# EasyEDA schematic 1-Schematic_LBB_Pi_HAT_V2.json
TITLE: LBB_Pi_HAT_V2; REV: 2.0; Date: 2020-11-04; Sheet: 1/1; Drawn By: rebusjwf; Company: LBB
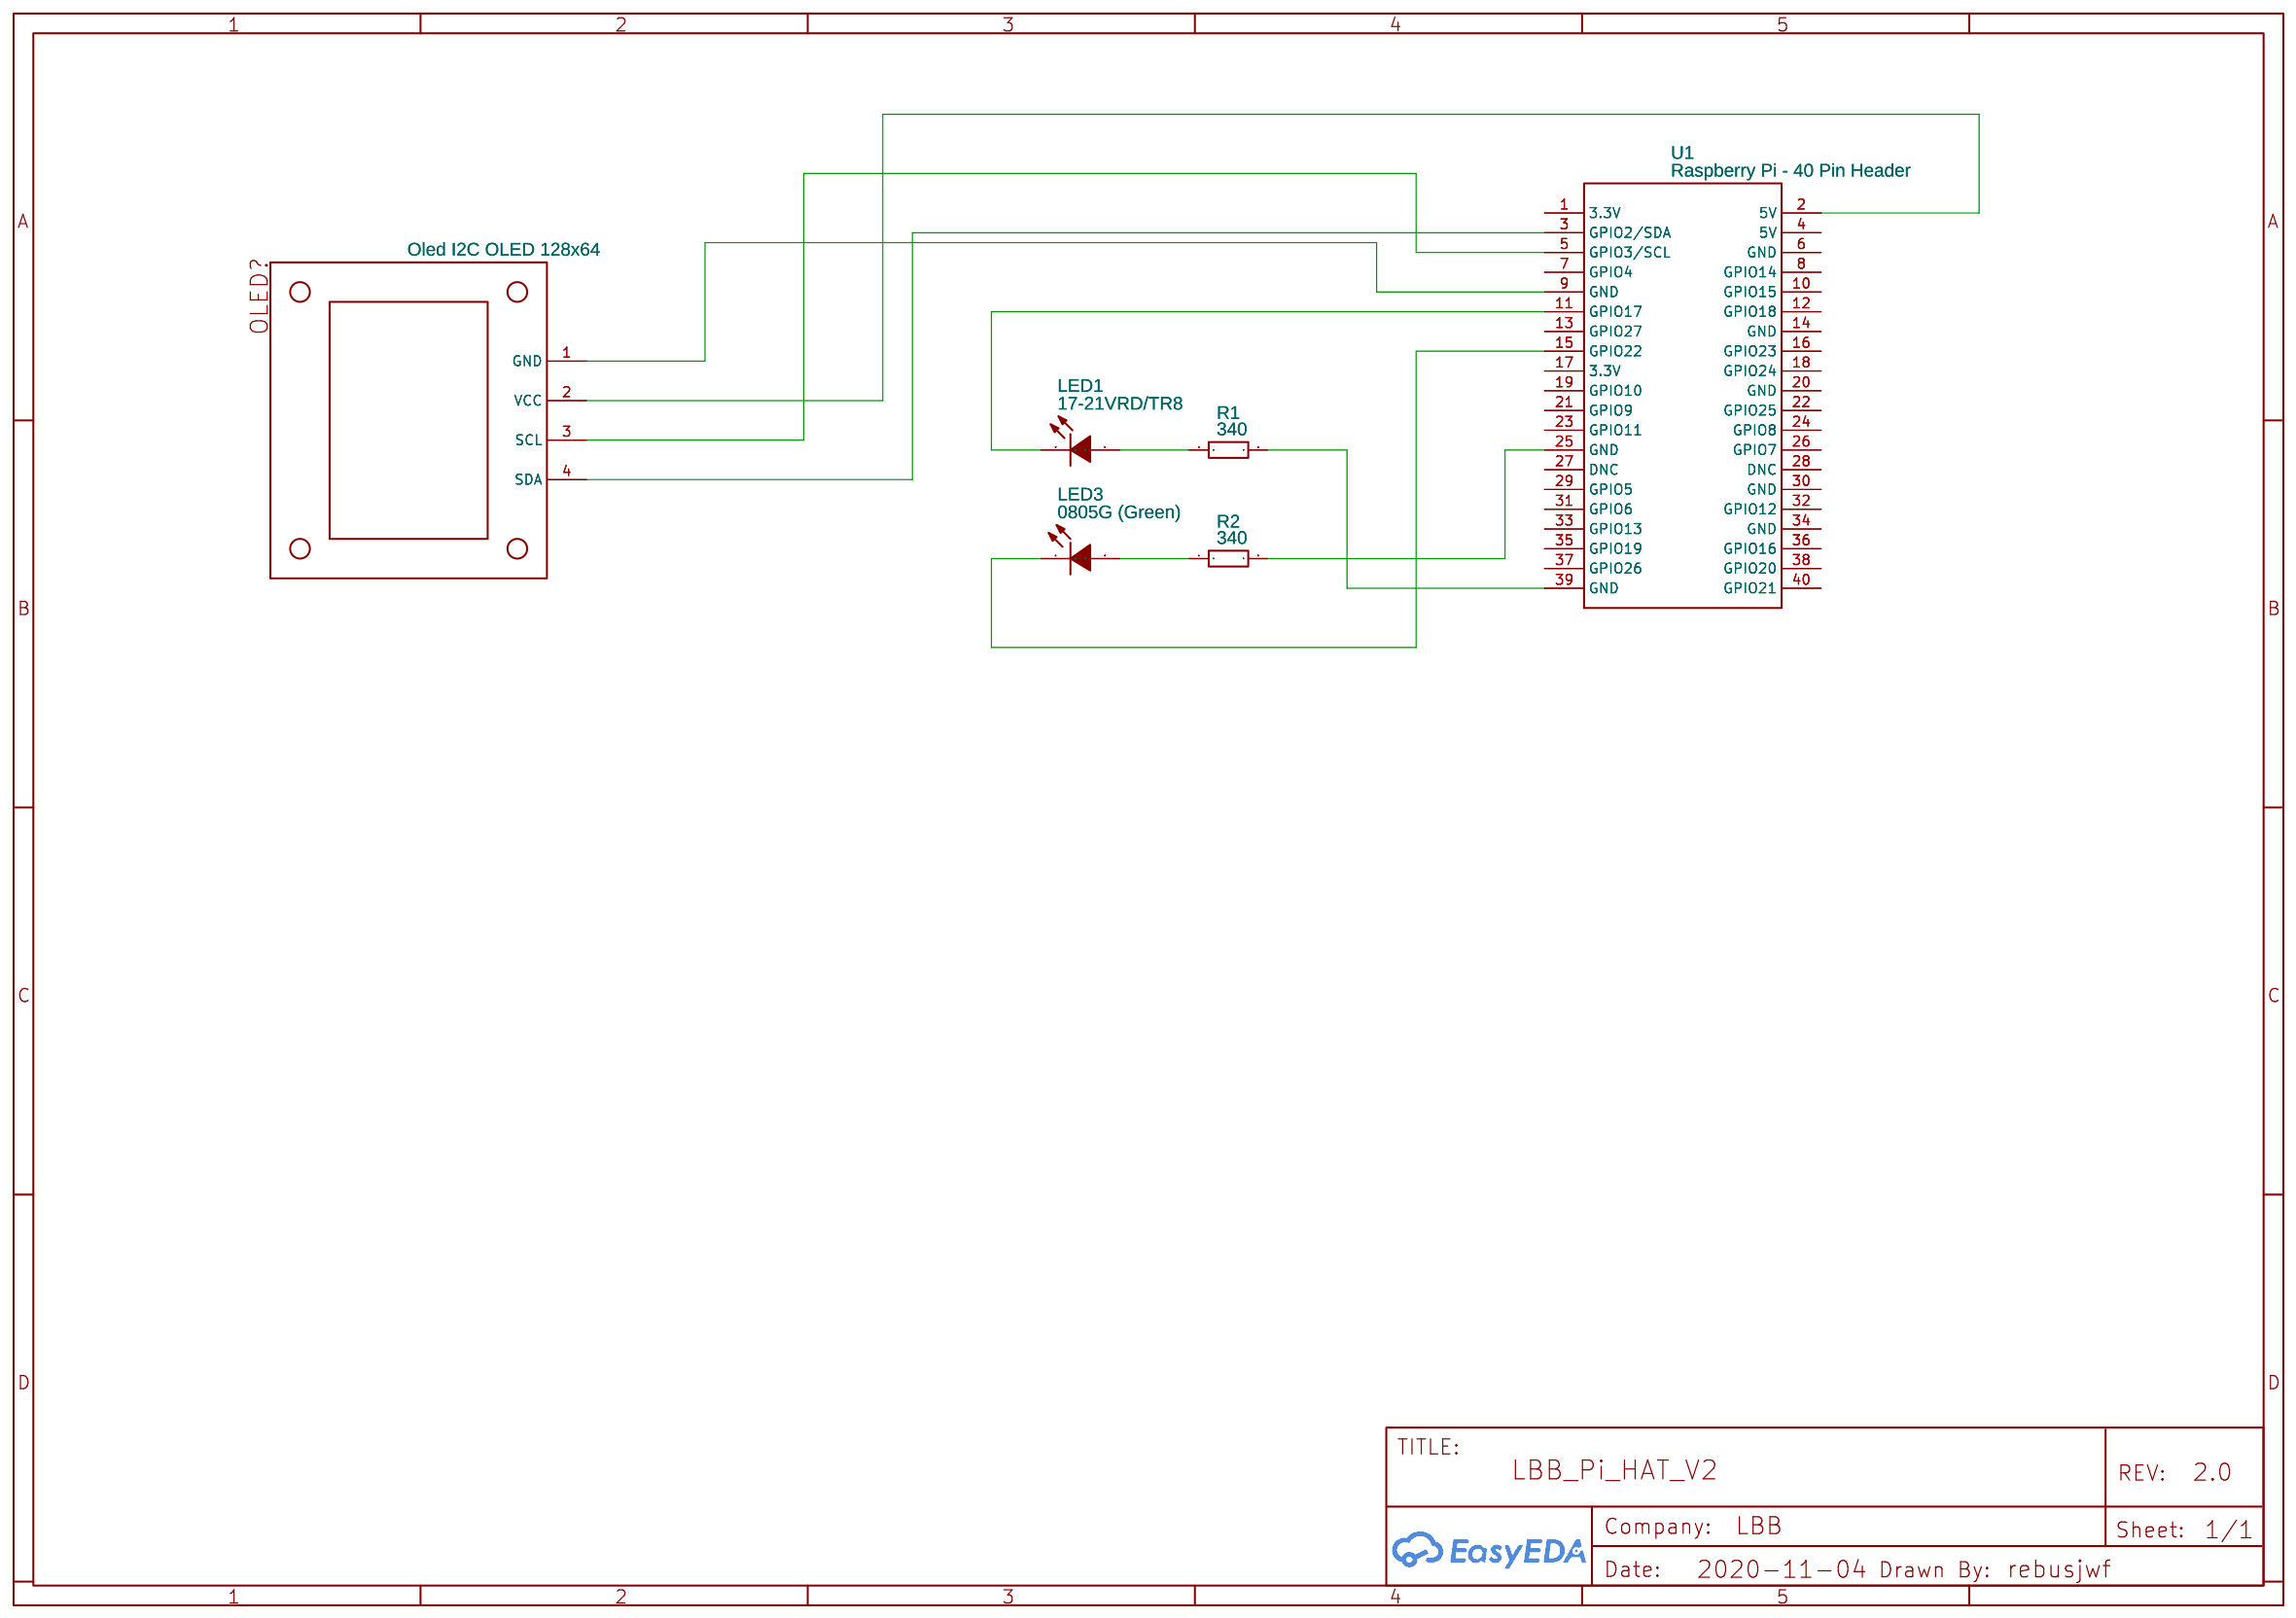
[diagram p0: schematic sheet]

## Parts
GND  Oled I2C OLED 128x64  [096OLED]
LED1  17-21VRD/TR8  [LED0805-R-RD]
LED3  0805G (Green)  [LED0805-RD]
R1  340  [R0402]
R2  340  [R0402]
U1  Raspberry Pi - 40 Pin Header  [HDR-TH_40P-P2.54-V-M-R2-C20-S2.54]

## Library data of the parts
GND = Oled I2C OLED 128x64: Supplier: Aliexpress; Contributor: mukujung2531
LED1 = 17-21VRD/TR8: Supplier: LCSC; Supplier Part: C264415; Manufacturer: Everlight Elec; Contributor: LCSC; LCSC Assembly: Yes; SMT Type: Extend
LED3 = 0805G (Green): Supplier: LCSC; Manufacturer: KENTO; LCSC Assembly: Yes; image: //image.lceda.cn/szlcsc/C2297.jpg; Supplier Part: C2297; SMT Type: Basic
R1 R2 = 0402WGF3400TCE: Supplier: LCSC; Supplier Part: C247118; Manufacturer: Uniroyal Elec; Contributor: LCSC; LCSC Assembly: Yes; SMT Type: Extend
U1 = Raspberry Pi - 40 Pin Header: Supplier: Raspberry Pi Foundation; Supplier Part: Raspberry Pi 40 Pin; link: https://pinout.xyz/; Contributor: joshgarde

## Nets
Net-(GND-1): GND.1(GND) U1.9(GND)
Net-(GND-2): GND.2(VCC) U1.2(5V)
Net-(GND-3): GND.3(SCL) U1.5(GPIO3/SCL)
Net-(GND-4): GND.4(SDA) U1.3(GPIO2/SDA)
Net-(LED1-1): LED1.1(A) R1.1
Net-(LED1-2): LED1.2(K) U1.11(GPIO17)
Net-(LED3-1): LED3.1(K) U1.15(GPIO22)
Net-(LED3-2): LED3.2(A) R2.1
Net-(R1-2): R1.2 U1.39(GND)
Net-(R2-2): R2.2 U1.25(GND)

Not connected (* = marked no-connect by the designer): U1 1(3.3V) 4(5V) 6(GND) 7(GPIO4) 8(GPIO14) 10(GPIO15) 12(GPIO18) 13(GPIO27) 14(GND) 16(GPIO23) 17(3.3V) 18(GPIO24) 19(GPIO10) 20(GND) 21(GPIO9) 22(GPIO25) 23(GPIO11) 24(GPIO8) 26(GPIO7) 27(DNC) 28(DNC) 29(GPIO5) 30(GND) 31(GPIO6) 32(GPIO12) 33(GPIO13) 34(GND) 35(GPIO19) 36(GPIO16) 37(GPIO26) 38(GPIO20) 40(GPIO21)
